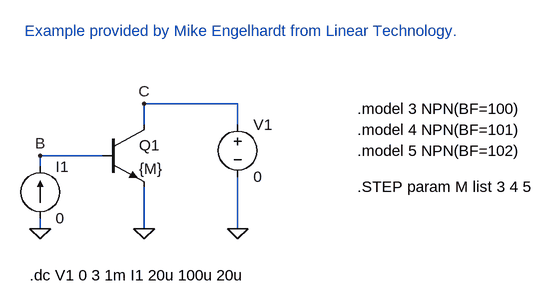
[diagram p0: schematic stepping_models_1.asc]
stepping_models_1.asc, the LTspice schematic file:
Version 4
SHEET 1 896 680
WIRE 32 384 32 368
WIRE 32 288 32 272
WIRE 32 272 128 272
WIRE 192 384 192 320
WIRE 192 224 192 192
WIRE 192 192 336 192
WIRE 336 192 336 224
WIRE 336 304 336 384
FLAG 192 384 0
FLAG 336 384 0
FLAG 32 384 0
FLAG 192 192 C
FLAG 32 272 B
SYMBOL npn 128 224 R0
SYMATTR InstName Q1
SYMATTR Value {M}
SYMBOL voltage 336 208 R0
SYMATTR InstName V1
SYMATTR Value 0
SYMBOL current 32 368 M180
WINDOW 0 24 79 Left 0
WINDOW 3 24 0 Left 0
SYMATTR InstName I1
SYMATTR Value 0
TEXT 16 456 Left 0 !.dc V1 0 3 1m I1 20u 100u 20u
TEXT 520 200 Left 0 !.model 3 NPN(BF=100)
TEXT 520 232 Left 0 !.model 4 NPN(BF=101)
TEXT 520 264 Left 0 !.model 5 NPN(BF=102)
TEXT 520 320 Left 0 !.STEP param M list 3 4 5
TEXT 8 80 Left 0 ;Example provided by Mike Engelhardt from Linear Technology.

The netlist it stands for:
* stepping_models_1.asc
Q1 C B 0 0 {M}
V1 C 0 0
I1 0 B 0
.model NPN NPN
.model PNP PNP
.lib standard.bjt
.dc V1 0 3 1m I1 20u 100u 20u
.model 3 NPN(BF=100)
.model 4 NPN(BF=101)
.model 5 NPN(BF=102)
.STEP param M list 3 4 5
* Example provided by Mike Engelhardt from Linear Technology.
.backanno
.end